# EAGLE design Esquemático (1) (EAGLE 9.6.2)
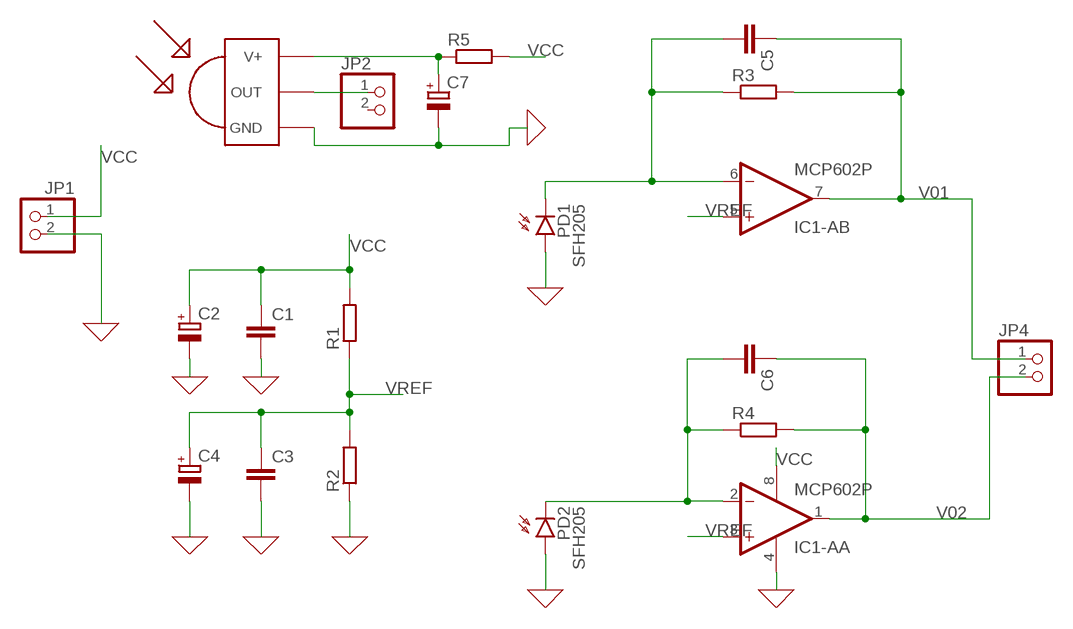
[diagram p0: schematic, sheet 1]

## Parts
C1  C-EU025-025X050  [C025-025X050]
C2  CPOL-EUE2.5-6  [E2,5-6]
C3  C-EU025-025X050  [C025-025X050]
C4  CPOL-EUE2.5-6  [E2,5-6]
C5  C-EU025-025X050  [C025-025X050]
C6  C-EU025-025X050  [C025-025X050]
C7  CPOL-EUE2.5-6  [E2,5-6]
IC1-A  MCP602P  [DIL08]
JP1  PINHD-1X2  [1X02]
JP2  PINHD-1X2  [1X02]
JP4  PINHD-1X2  [1X02]
PD1  SFH205  [SFH205]
PD2  SFH205  [SFH205]
R1  R-EU_0207/10  [0207/10]
R2  R-EU_0207/10  [0207/10]
R3  R-EU_0207/10  [0207/10]
R4  R-EU_0207/10  [0207/10]
R5  R-EU_0207/10  [0207/10]
U$1  TSOP4856  [TSOP18XX]

## Nets
0: C1.2 C2.- C3.2 C4.- C7.- IC1-A.4(P:V-) JP1.2 PD1.A PD2.A R2.1 U$1.GND ; supply symbol labelled GND
N$2: C7.+ R5.1 U$1.VCC(V+)
N$3: JP2.1 U$1.OUT
N$4: C6.2 IC1-A.2(A:-IN) PD2.K(C) R4.1
N$5: C5.2 IC1-A.6(B:-IN) PD1.K(C) R3.1
V01: C5.1 IC1-A.7(B:OUT) JP4.1 R3.2
V02: C6.1 IC1-A.1(A:OUT) JP4.2 R4.2
VCC: C1.1 C2.+ IC1-A.8(P:V+) JP1.1 R1.2 R5.2
VREF: C3.1 C4.+ IC1-A.3(A:+IN) IC1-A.5(B:+IN) R1.1 R2.2
Unconnected: JP2.2

## Library data of the parts
C1 C3 C5 C6 = LabE:C-EU: CAPACITOR, European symbol; SPICEPREFIX: C
C2 C4 C7 = LabE:CPOL-EU: POLARIZED CAPACITOR, European symbol; SPICEPREFIX: C
IC1-A = LabE:MCP602: Single Op Amp 2.7V to 6.0V Single Supply CMOS Source: http://ww1.microchip.com/downloads/en/DeviceDoc/21314g.pdf
JP1 JP2 JP4 = LabE:PINHD-1X2: PIN HEADER
PD1 PD2 = opto-trans-siemens:SFH205: PHOTO DIODE; OC_FARNELL: unknown; OC_NEWARK: unknown
R1-R5 = LabE:R-EU_: RESISTOR, European symbol; SPICEPREFIX: R
U$1 = tsop:TSOP4856: IR Receiver and Demodulator

## Board
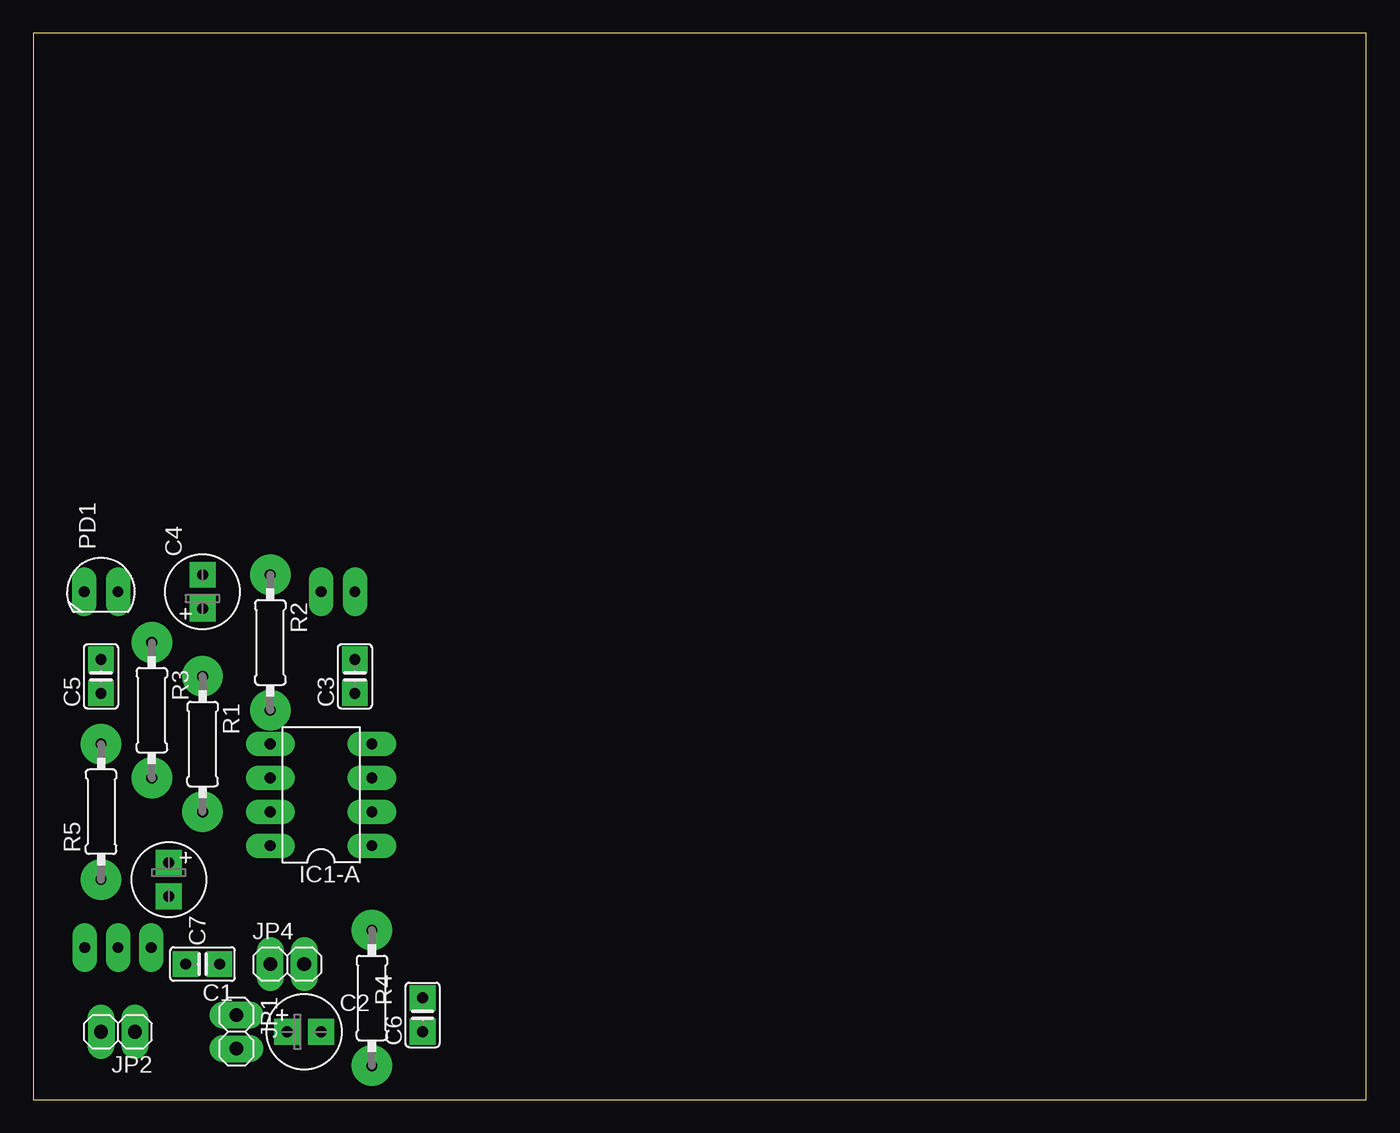
[diagram p1: board, top side]
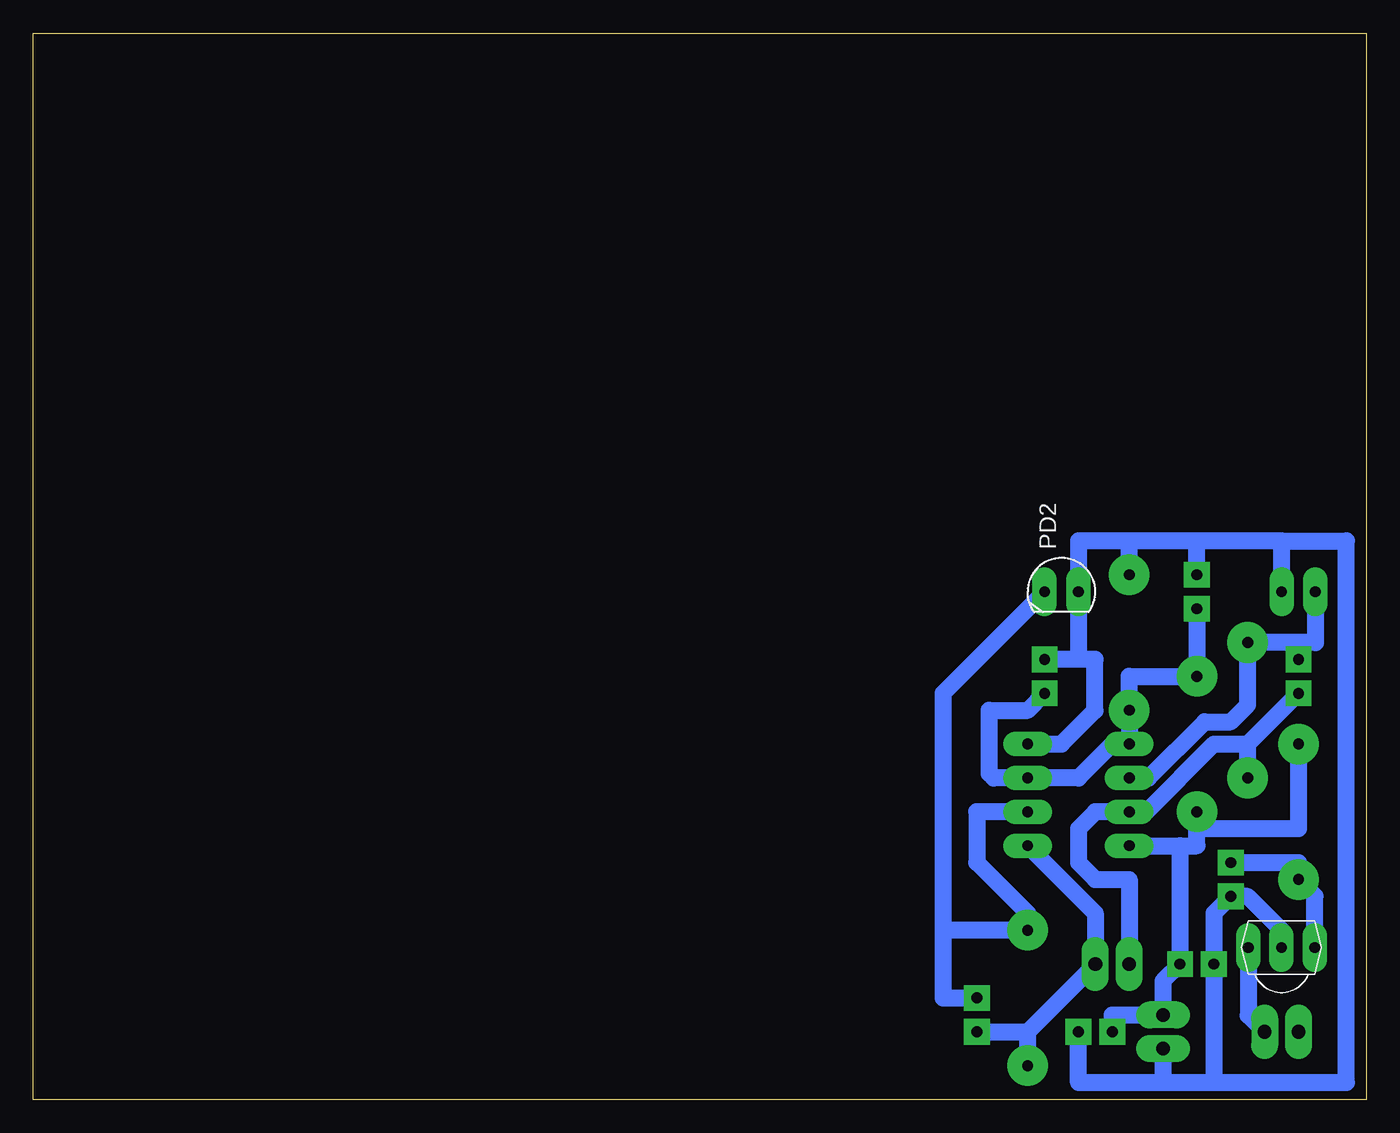
[diagram p2: board, bottom side, seen from below]

Size 100 x 80 mm. Coordinates in mm from the lower left corner, seen from the top.
Outline: 0,0 100,0 100,80 0,80 0,0
Copper layers (1*16): Top 0.035mm / dielectric 1.5mm / Bottom 0.035mm
Design rules "LabE": minimum track width 50mil, minimum drill 0.8mm, track to track 16mil, track to pad 16mil, pad to pad 16mil, via to via 16mil, smd to smd 16mil, copper to edge 0mil, drill to drill 16mil, minimum pad ring 20mil, minimum via ring 20mil, stop-mask expansion 4mil, vias tented up to drill 0mil, thermal gap 10mil

### Footprints (pad centres in the part's own frame; a part is rotated, then mirrored left to right if it is on the bottom)
C025-025X050 = drill 0.813 pad 1.93 square: 1 -1.27,0; 2 1.27,0
E2,5-6 = drill 0.813 pad 1.93 square: + -1.27,0; - 1.27,0
DIL08 = drill 0.813 pad 1.778 long: 1 -3.81,-3.81; 2 -1.27,-3.81; 3 1.27,-3.81; 4 3.81,-3.81; 5 3.81,3.81; 6 1.27,3.81; 7 -1.27,3.81; 8 -3.81,3.81
1X02 = drill 1.016 long: 1 -1.27,0; 2 1.27,0
SFH205 = drill 0.813 long: A 0,-1.27; K 0,1.27
0207/10 = drill 0.813 pad 3.048: 1 -5.08,0; 2 5.08,0
TSOP18XX = drill 0.813 long: GND -0.001,-0.027; OUT -2.501,-0.027; VCC 2.499,-0.027

### Placement (x,y rotation side)
C1  12.7,10.16 180 top
C2  20.32,5.08 0 top
C3  24.13,31.75 90 top
C4  12.7,38.1 90 top
C5  5.08,31.75 90 top
C6  29.21,6.35 90 top
C7  10.16,16.51 270 top
IC1-A  21.59,22.86 90 top
JP1  15.24,5.08 270 top
JP2  6.35,5.08 180 top
JP4  19.05,10.16 0 top
PD1  5.08,38.1 90 top
PD2  22.86,38.1 90 bottom
R1  12.7,26.67 270 top
R2  17.78,34.29 270 top
R3  8.89,29.21 270 top
R4  25.4,7.62 270 top
R5  5.08,21.59 90 top
U$1  6.35,11.43 0 bottom

### Tracks (layer width: path | path; a pad name or v marks a point on that pad's centre or on a via)
0
  Bottom 1.27: PD1.A 6.35,41.91 | 11.43,1.27 1.48,1.27 1.48,41.91 6.35,41.91 | 11.43,1.27 15.24,1.27 | 15.24,1.27 21.59,1.27 C2.- | 11.43,1.27 C1.2 11.43,13.97 C7.- 8.89,15.24 6.35,12.7 U$1.GND | JP1.2 15.24,1.27 | IC1-A.4 22.86,26.67 20.34,29.18 20.34,32.99 20.32,33.02 21.59,33.02 | 21.59,33.02 C3.2 | 21.59,33.02 PD2.A 21.59,41.91 17.78,41.91 | R2.1 17.78,41.91 | 6.35,41.91 12.7,41.91 | 12.7,41.91 17.78,41.91 | C4.- 12.7,41.91
N$2
  Bottom 1.27: U$1.VCC 3.85,15.28 R5.1 5.08,17.78 C7.+
N$3
  Bottom 1.27: U$1.OUT 8.85,6.31 JP2.1
N$4
  Bottom 1.27: C6.2 31.75,7.62 31.75,12.7 | IC1-A.2 29.21,21.59 29.21,17.78 25.4,13.97 R4.1 31.75,12.7 | 31.75,12.7 31.75,30.48 PD2.K
N$5
  Bottom 1.27: C5.2 5.08,34.29 | 5.08,34.29 3.81,34.29 PD1.K | 5.08,34.29 R3.1 8.89,29.62 10.16,28.35 12.12,28.35 16.34,24.13 IC1-A.6
V01
  Bottom 1.27: R3.2 8.89,26.67 | 8.89,26.67 C5.1 | JP4.1 17.78,16.51 20.32,16.51 21.59,17.78 21.59,20.32 20.32,21.59 IC1-A.7 16.51,21.59 11.43,26.67 8.89,26.67
V02
  Bottom 1.27: R4.2 25.4,5.08 | 25.4,5.08 JP4.2 20.32,13.97 IC1-A.1 | C6.1 25.4,5.08
VCC
  Bottom 1.27: C2.+ 19.05,6.35 JP1.1 15.24,8.89 C1.1 13.97,19.05 | R5.2 5.08,20.32 12.7,20.32 | IC1-A.8 13.97,19.05 | 13.97,19.05 12.7,19.05 12.7,20.32 | 12.7,20.32 R1.2
VREF
  Bottom 1.27: C4.+ R1.1 17.78,31.75 R2.2 IC1-A.5 19.05,26.67 21.59,24.13 IC1-A.3 27.94,24.13 28.27,24.46 28.27,29.21 25.4,29.21 C3.1